# EAGLE schematic EEG (EAGLE 9.6.2)
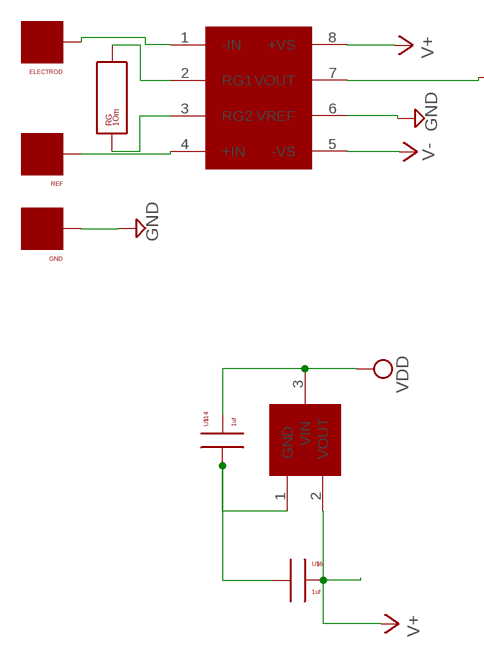
[diagram p0: schematic, sheet 1, part 1 of 2]
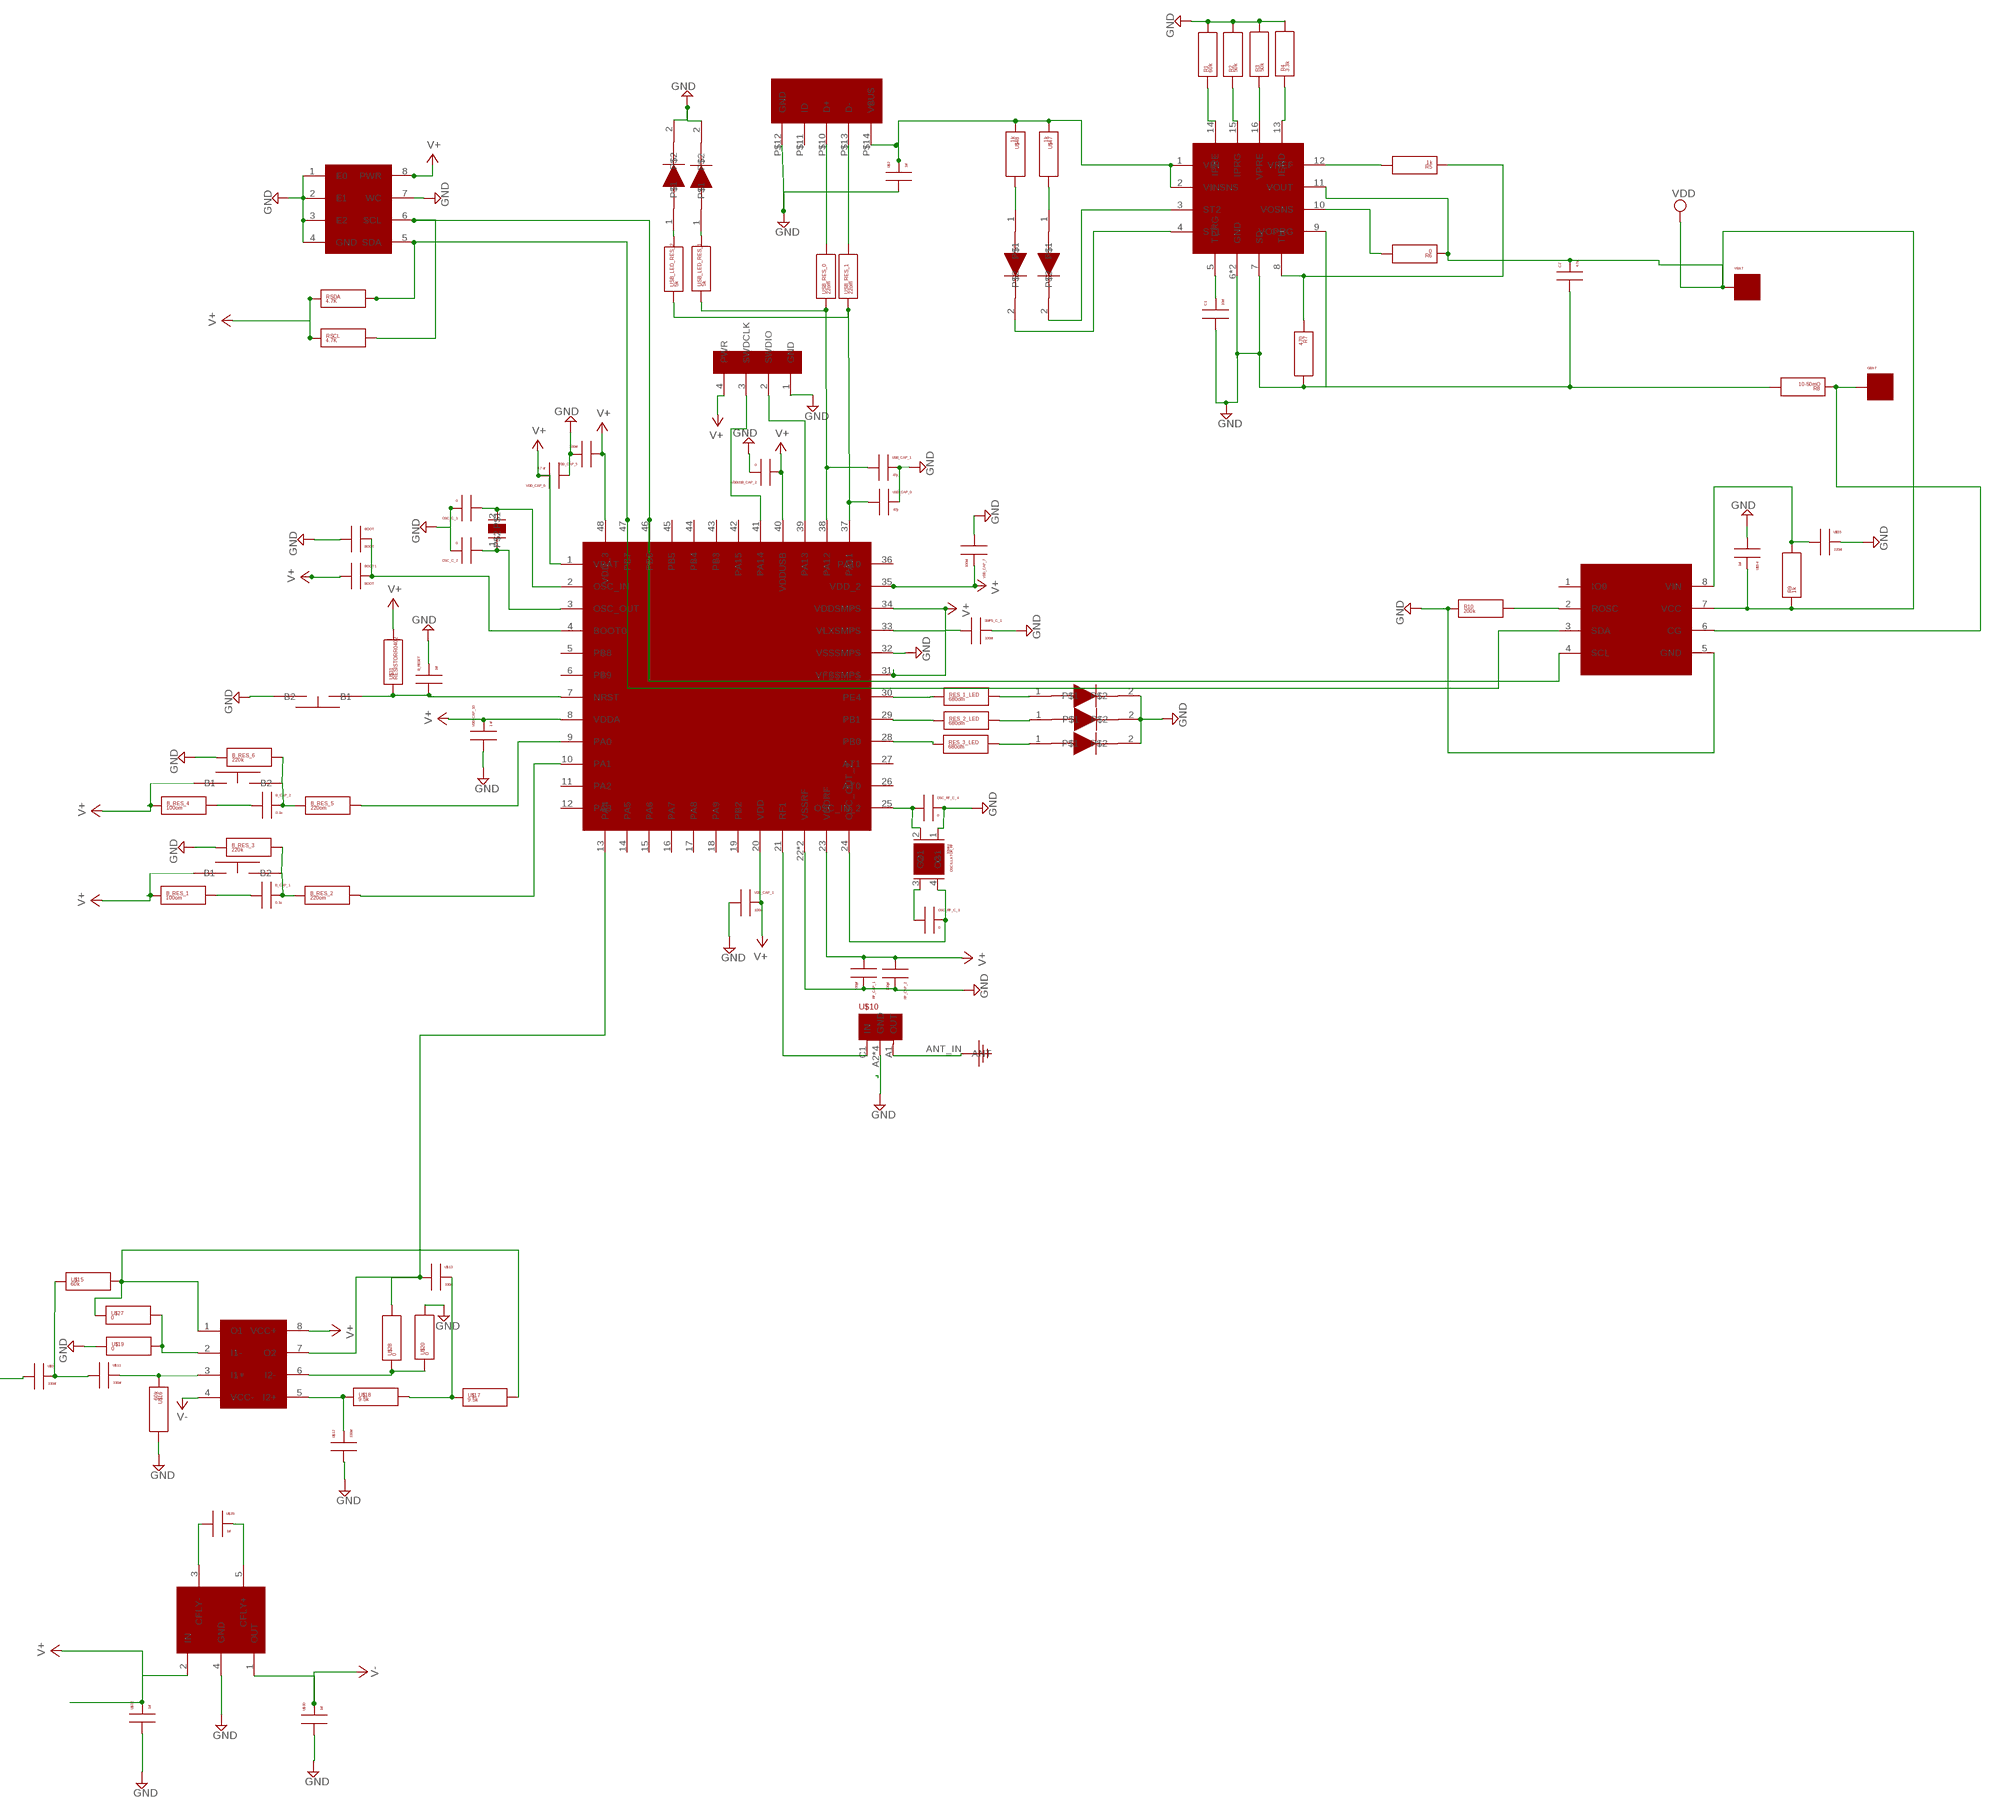
[diagram p1: schematic, sheet 1, part 2 of 2]

## Parts
B_CAP_1  0.1u  CAPACITORC0402  [C0402]
B_CAP_2  0.1u  CAPACITORC0402  [C0402]
B_RES_1  100om  RESISTORR0402  [R0402]
B_RES_2  220om  RESISTORR0402  [R0402]
B_RES_3  220k  RESISTORR0402  [R0402]
B_RES_4  100om  RESISTORR0402  [R0402]
B_RES_5  220om  RESISTORR0402  [R0402]
B_RES_6  220k  RESISTORR0402  [R0402]
B_RESET  1uf  CAPACITORC0402  [C0402]
BOOT  BOOT  CAPACITORC0402  [C0402]
BOOT1  BOOT  CAPACITORC0402  [C0402]
BUTTON1  BUTTON  [BUTTON]
BUTTON2  BUTTON  [BUTTON]
C1  10nf  CAPACITORC0402  [C0402]
C2  4.7uf  CAPACITORC0402  [C0402]
ELECTROD  PIN-1  [PIN-1]
GBAT  PIN-1  [PIN-1]
GND  PIN-1  [PIN-1]
LED_1  LED  [R0402]
LED_2  LED  [R0402]
LED_3  LED  [R0402]
OSC_C_1  0  CAPACITORC0402  [C0402]
OSC_C_2  0  CAPACITORC0402  [C0402]
OSC_RF_C_3  0  CAPACITORC0402  [C0402]
OSC_RF_C_4  0  CAPACITORC0402  [C0402]
OSCILLATOR_RF  32mhz  NX2520SA  [NX2520SA]
R1  60k  RESISTORR0402  [R0402]
R2  50k  RESISTORR0402  [R0402]
R3  50k  RESISTORR0402  [R0402]
R4  3.3k  RESISTORR0402  [R0402]
R5  1k  RESISTORR0402  [R0402]
R6  0  RESISTORR0402  [R0402]
R7  470  RESISTORR0402  [R0402]
R8  10-50mO  RESISTORR0402  [R0402]
R9  1k  RESISTORR0402  [R0402]
R10  200k  RESISTORR0402  [R0402]
REF  PIN-1  [PIN-1]
RES_1_LED  680om  RESISTORR0402  [R0402]
RES_2_LED  680om  RESISTORR0402  [R0402]
RES_3_LED  680om  RESISTORR0402  [R0402]
RF_CAP_1  100pf  CAPACITORC0402  [C0402]
RF_CAP_2  100pf  CAPACITORC0402  [C0402]
RG  1Om  RESISTORR0402  [R0402]
RSCL  4.7K  RESISTORR0402  [R0402]
RSDA  4.7K  RESISTORR0402  [R0402]
SMPS_C_1  100nf  CAPACITORC0402  [C0402]
U$1  STM32WB55  [STM32WB55]
U$2  1uf  CAPACITORC0402  [C0402]
U$3  ANT  [ANT]
U$4  AD8422  [AD8422]
U$5  TPS60403  [TPS60403]
U$6  1uf  CAPACITORC0402  [C0402]
U$7  LM358  [LM358]
U$8  MCP1703  [MCP1703]
U$9  330nf  CAPACITORC0402  [C0402]
U$10  MLPF-WB55-01E3DEFAULT  [MLPF-WB55-01E3]
U$11  330nf  CAPACITORC0402  [C0402]
U$12  330nf  CAPACITORC0402  [C0402]
U$13  330nf  CAPACITORC0402  [C0402]
U$14  1uf  CAPACITORC0402  [C0402]
U$15  60k  RESISTORR0402  [R0402]
U$16  60k  RESISTORR0402  [R0402]
U$17  9.5k  RESISTORR0402  [R0402]
U$18  9.5k  RESISTORR0402  [R0402]
U$19  0  RESISTORR0402  [R0402]
U$20  0  RESISTORR0402  [R0402]
U$21  M24M01  [M24M01]
U$22  USBUSBT  [USBT]
U$23  SWDSWDD  [SWD]
U$24  STC3100  [STC3100]
U$25  L6924D  [L6924D]
U$26  BUTTON  [BUTTON]
U$27  0  RESISTORR0402  [R0402]
U$28  0  RESISTORR0402  [R0402]
U$29  1uf  CAPACITORC0402  [C0402]
U$30  1uf  CAPACITORC0402  [C0402]
U$31  RESISTORR0402  [R0402]
U$32  1uf  CAPACITORC0402  [C0402]
U$33  OSC_32KH  [RESM2012X60N]
U$47  1k  RESISTORR0402  [R0402]
U$48  1k  RESISTORR0402  [R0402]
U$49  LED  [R0402]
U$50  LED  [R0402]
U$54  1uf  CAPACITORC0402  [C0402]
U$55  220nf  CAPACITORC0402  [C0402]
USB_CAP_0  47p  CAPACITORC0402  [C0402]
USB_CAP_1  47p  CAPACITORC0402  [C0402]
USB_LED_1  LED  [R0402]
USB_LED_2  LED  [R0402]
USB_LED_RES_1  5k  RESISTORR0402  [R0402]
USB_LED_RES_2  5k  RESISTORR0402  [R0402]
USB_RES_0  22om  RESISTORR0402  [R0402]
USB_RES_1  22om  RESISTORR0402  [R0402]
VBAT  PIN-1  [PIN-1]
VDD_CAP_1  100nf  CAPACITORC0402  [C0402]
VDD_CAP_5  100nf  CAPACITORC0402  [C0402]
VDD_CAP_6  4.7 uf  CAPACITORC0402  [C0402]
VDD_CAP_7  100nf  CAPACITORC0402  [C0402]
VDD_CAP_10  1 uf  CAPACITORC0402  [C0402]
VDDUSB_CAP_2  0  CAPACITORC0402  [C0402]

## Nets
GND: B_RES_3.1 B_RES_6.1 B_RESET.2 BOOT.1 C1.1 C2.1 GND.P$1(PIN) LED_1.2 LED_2.2 LED_3.2 OSC_C_1.2 OSC_C_2.2 OSC_RF_C_4.2 OSCILLATOR_RF.1(G1) R1.2 R2.2 R3.2 R4.2 R7.2 R8.2 R10.1 RF_CAP_1.2 RF_CAP_2.2 SMPS_C_1.2 U$1.22(VSSRF) U$1.32(VSSSMPS) U$1.49(VSSRF) U$2.1 U$4.6(VREF) U$5.4(GND) U$10.A2(GND) U$10.B1(GND) U$10.B2(GND) U$10.C2(GND) U$12.1 U$16.2 U$19.1 U$20.2 U$21.1(E0) U$21.2(E1) U$21.3(E2) U$21.4(GND) U$21.7(WC) U$22.P$12(GND) U$23.1(GND) U$24.5(GND) U$25.6(GND) U$25.7(SD) U$25.9(VOPRG) U$25.17(GND) U$26.2(B2) U$30.1 U$32.1 U$54.1 U$55.2 USB_CAP_0.2 USB_CAP_1.2 USB_LED_1.2 USB_LED_2.2 VDD_CAP_1.1 VDD_CAP_5.2 VDD_CAP_6.1 VDD_CAP_7.1 VDD_CAP_10.1 VDDUSB_CAP_2.2
N$1: U$1.21(RF1) U$10.C1(IN)
N$2: BOOT1.2 BOOT.2 U$1.4(BOOT0)
N$3: U$1.39(PA13) U$23.2(SWDIO)
N$4: OSC_RF_C_4.1 OSCILLATOR_RF.2(O1) U$1.25(OSC_IN_2)
N$5: U$1.41(PA14) U$23.3(SWDCLK)
N$6: RES_1_LED.1 U$1.30(PE4)
N$7: U$3.ANT_IN(ANT) U$10.A1(OUT)
N$8: RES_2_LED.1 U$1.29(PB1)
N$9: RES_3_LED.1 U$1.28(PB0)
N$10: LED_1.1 RES_1_LED.2
N$11: LED_2.1 RES_2_LED.2
N$12: LED_3.1 RES_3_LED.2
N$13: U$1.37(PA11) USB_CAP_0.1 USB_LED_RES_2.1 USB_RES_1.1
N$14: U$1.38(PA12) USB_CAP_1.1 USB_LED_RES_1.1 USB_RES_0.1
N$15: R10.2 U$24.2(ROSC)
N$16: B_RES_5.2 U$1.9(PA0)
N$18: B_CAP_2.2 B_RES_5.1 B_RES_6.2 BUTTON1.2(B2)
N$19: U$22.P$10(D+) USB_RES_0.2
N$20: U$22.P$13(D-) USB_RES_1.2
N$21: U$2.2 U$22.P$14(VBUS) U$25.1(VIN) U$25.2(VINSNS) U$47.1 U$48.1
N$22: R2.1 U$25.15(IPRG)
N$23: RSDA.2 U$1.47(PB7) U$21.5(SDA) U$24.3(SDA)
N$24: B_CAP_2.1 B_RES_4.2
N$25: B_RES_2.2 U$1.10(PA1)
N$26: OSC_C_2.1 U$1.3(OSC_OUT) U$33.1
N$27: B_RESET.1 U$1.7(NRST) U$26.1(B1) U$31.1
N$28: OSC_C_1.1 U$1.2(OSC_IN) U$33.2
N$29: USB_LED_2.1 USB_LED_RES_2.2
N$30: OSC_RF_C_3.1 OSCILLATOR_RF.3(G2)
N$31: C1.2 U$25.5(TPRG)
N$32: U$48.2 U$50.1
N$33: U$47.2 U$49.1
N$34: R3.1 U$25.16(VPRE)
N$35: U$25.3(ST2) U$49.2
N$36: U$25.4(ST1) U$50.2
N$38: R4.1 U$25.13(IEND)
N$39: R1.1 U$25.14(IPRE)
N$42: R9.2 U$24.8(VIN) U$55.1
N$44: R5.1 R7.1 U$25.8(TH)
N$45: R5.2 U$25.12(VREF)
N$46: RSCL.2 U$1.46(PB6) U$21.6(SCL) U$24.4(SCL)
N$47: R6.2 U$25.10(VOSNS)
N$48: GBAT.P$1(PIN) R8.1 U$24.6(CG)
N$49: USB_LED_1.1 USB_LED_RES_1.2
N$52: RG.2 U$4.2(RG1)
N$53: RG.1 U$4.3(RG2)
N$54: REF.P$1(PIN) U$4.4(+IN)
N$55: ELECTROD.P$1(PIN) U$4.1(-IN)
N$56: U$4.7(VOUT) U$9.1
N$57: U$7.1(O1) U$15.2 U$17.2 U$27.1
N$58: U$7.3(I1+) U$11.2 U$16.1
N$59: U$9.2 U$11.1 U$15.1
N$60: U$7.2(I1-) U$19.2 U$27.2
N$61: U$7.5(I2+) U$12.2 U$18.1
N$62: U$13.2 U$17.1 U$18.2
N$63: U$1.13(PA4) U$7.7(O2) U$13.1 U$28.2
N$64: U$7.6(I2-) U$20.1 U$28.1
N$65: B_CAP_1.2 B_RES_2.1 B_RES_3.2 BUTTON2.2(B2)
N$66: U$6.1 U$8.1(GND) U$14.1
N$67: U$5.3(CFLY-) U$29.1
N$68: U$5.5(CFLY+) U$29.2
N$69: B_CAP_1.1 B_RES_1.2
N$74: OSC_RF_C_3.2 OSCILLATOR_RF.4(O2) U$1.24(OSC_OUT_2)
V+: B_RES_1.1 B_RES_4.1 BOOT1.1 BUTTON1.1(B1) BUTTON2.1(B1) RF_CAP_1.1 RF_CAP_2.1 RSCL.1 RSDA.1 SMPS_C_1.1 U$1.1(VBAT) U$1.8(VDDA) U$1.20(VDD) U$1.23(VDDRF) U$1.31(VFBSMPS) U$1.33(VLXSMPS) U$1.34(VDDSMPS) U$1.35(VDD_2) U$1.40(VDDUSB) U$1.48(VDD_3) U$4.8(+VS) U$5.2(IN) U$6.2 U$7.8(VCC+) U$8.2(VOUT) U$21.8(PWR) U$23.4(PWR) U$31.2 U$32.2 VDD_CAP_1.2 VDD_CAP_5.1 VDD_CAP_6.2 VDD_CAP_7.2 VDD_CAP_10.2 VDDUSB_CAP_2.1
V-: U$4.5(-VS) U$5.1(OUT) U$7.4(VCC-) U$30.2
VDD: C2.2 R6.1 R9.1 U$8.3(VIN) U$14.2 U$24.7(VCC) U$25.11(VOUT) U$54.2 VBAT.P$1(PIN)
Unconnected: U$1.5(PB8) U$1.6(PB9) U$1.11(PA2) U$1.12(PA3) U$1.14(PA5) U$1.15(PA6) U$1.16(PA7) U$1.17(PA8) U$1.18(PA9) U$1.19(PB2) U$1.26(AT0) U$1.27(AT1) U$1.36(PA10) U$1.42(PA15) U$1.43(PB3) U$1.44(PB4) U$1.45(PB5) U$22.P$11(ID) U$24.1(IO0)

## Notes on the sheet
- ADC

## Library data of the parts
B_CAP_1 B_CAP_2 B_RESET BOOT BOOT1 C1 C2 OSC_C_1 OSC_C_2 OSC_RF_C_3 OSC_RF_C_4 RF_CAP_1 RF_CAP_2 SMPS_C_1 U$2 U$6 U$9 U$11-U$14 U$29 U$30 U$32 U$54 U$55 USB_CAP_0 USB_CAP_1 VDD_CAP_1 VDD_CAP_5-VDD_CAP_7 VDD_CAP_10 VDDUSB_CAP_2 = EEG:CAPACITOR
B_RES_1-B_RES_6 R1-R10 RES_1_LED RES_2_LED RES_3_LED RG RSCL RSDA U$15-U$20 U$27 U$28 U$31 U$47 U$48 USB_LED_RES_1 USB_LED_RES_2 USB_RES_0 USB_RES_1 = EEG:RESISTOR
BUTTON1 BUTTON2 U$26 = EEG:BUTTON
ELECTROD GBAT GND REF VBAT = EEG:PIN-1
LED_1-LED_3 U$49 U$50 USB_LED_1 USB_LED_2 = EEG:LED
OSCILLATOR_RF = EEG:NX2520SA
U$1 = EEG:STM32WB55
U$3 = EEG:ANT
U$4 = EEG:AD8422
U$5 = EEG:TPS60403
U$7 = EEG:LM358
U$8 = EEG:MCP1703
U$10 = EEG:MLPF-WB55-01E3
U$21 = EEG:M24M01
U$22 = EEG:USB
U$23 = EEG:SWD
U$24 = EEG:STC3100
U$25 = EEG:L6924D
U$33 = EEG:OSC_32KH